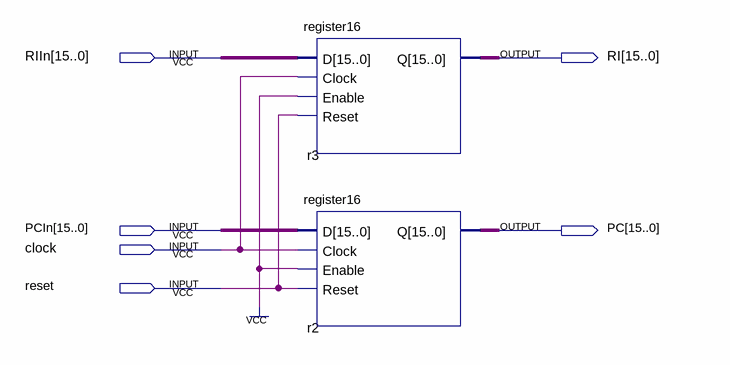
[diagram p0: schematic sheet]
// Quartus schematic pipeline1.bdf as structural Verilog: 2 symbols, 6 pins
module pipeline1 (
  input  [15:0] RIIn,
  input  [15:0] PCIn,
  input  clock,
  input  reset,
  output [15:0] RI,
  output [15:0] PC
);

  register16 r3 (.D(RIIn), .Clock(clock), .Enable(1'b1), .Reset(reset), .Q(RI));
  register16 r2 (.D(PCIn), .Clock(clock), .Enable(1'b1), .Reset(reset), .Q(PC));
endmodule
